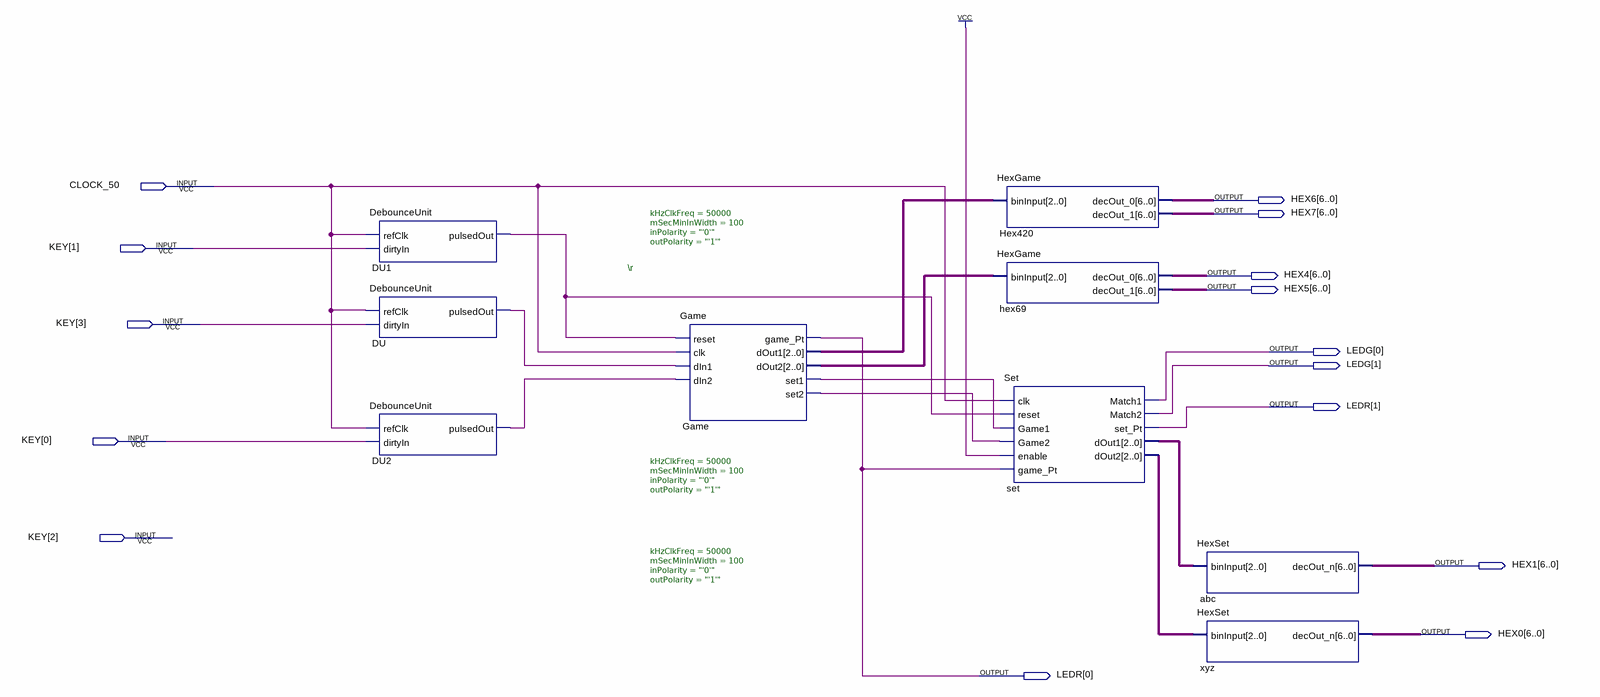
[diagram p0: schematic sheet]
// Quartus schematic GameSetTest.bdf as structural Verilog: 9 symbols, 15 pins
module GameSetTest (
  input  CLOCK_50,
  input  [3:0] KEY,
  output [6:0] HEX6,
  output [6:0] HEX7,
  output [6:0] HEX4,
  output [6:0] HEX5,
  output [1:0] LEDG,
  output [1:0] LEDR,
  output [6:0] HEX1,
  output [6:0] HEX0
);

  wire DU1_pulsedout, DU2_pulsedout, DU_pulsedout, Game_set1, Game_set2;
  wire [2:0] Game_dout1, Game_dout2, set_dout1, set_dout2;

  DebounceUnit #(.kHzClkFreq(50000), .mSecMinInWidth(100), .inPolarity("'0'"), .outPolarity("'1'")) DU1 (
    .refClk(CLOCK_50), .dirtyIn(KEY[1]), .pulsedOut(DU1_pulsedout));
  DebounceUnit #(.kHzClkFreq(50000), .mSecMinInWidth(100), .inPolarity("'0'"), .outPolarity("'1'")) DU (
    .refClk(CLOCK_50), .dirtyIn(KEY[3]), .pulsedOut(DU_pulsedout));
  DebounceUnit #(.kHzClkFreq(50000), .mSecMinInWidth(100), .inPolarity("'0'"), .outPolarity("'1'")) DU2 (
    .refClk(CLOCK_50), .dirtyIn(KEY[0]), .pulsedOut(DU2_pulsedout));
  Game Game (
    .reset(DU1_pulsedout), .clk(CLOCK_50), .dIn1(DU_pulsedout), .dIn2(DU2_pulsedout), .game_Pt(LEDR[0]),
    .dOut1(Game_dout1), .dOut2(Game_dout2), .set1(Game_set1), .set2(Game_set2));
  HexGame Hex420 (.binInput(Game_dout1), .decOut_0(HEX6), .decOut_1(HEX7));
  HexGame hex69 (.binInput(Game_dout2), .decOut_0(HEX4), .decOut_1(HEX5));
  Set set (
    .clk(CLOCK_50), .reset(DU1_pulsedout), .Game1(Game_set1), .Game2(Game_set2), .enable(1'b1),
    .game_Pt(LEDR[0]), .Match1(LEDG[0]), .Match2(LEDG[1]), .set_Pt(LEDR[1]), .dOut1(set_dout1),
    .dOut2(set_dout2));
  HexSet abc (.binInput(set_dout1), .decOut_n(HEX1));
  HexSet xyz (.binInput(set_dout2), .decOut_n(HEX0));

  // Notes on the sheet:
  //   \r
endmodule
